# EAGLE schematic dual-channel-buck-v0 (EAGLE 5.07)

## Sheet 1 of 2
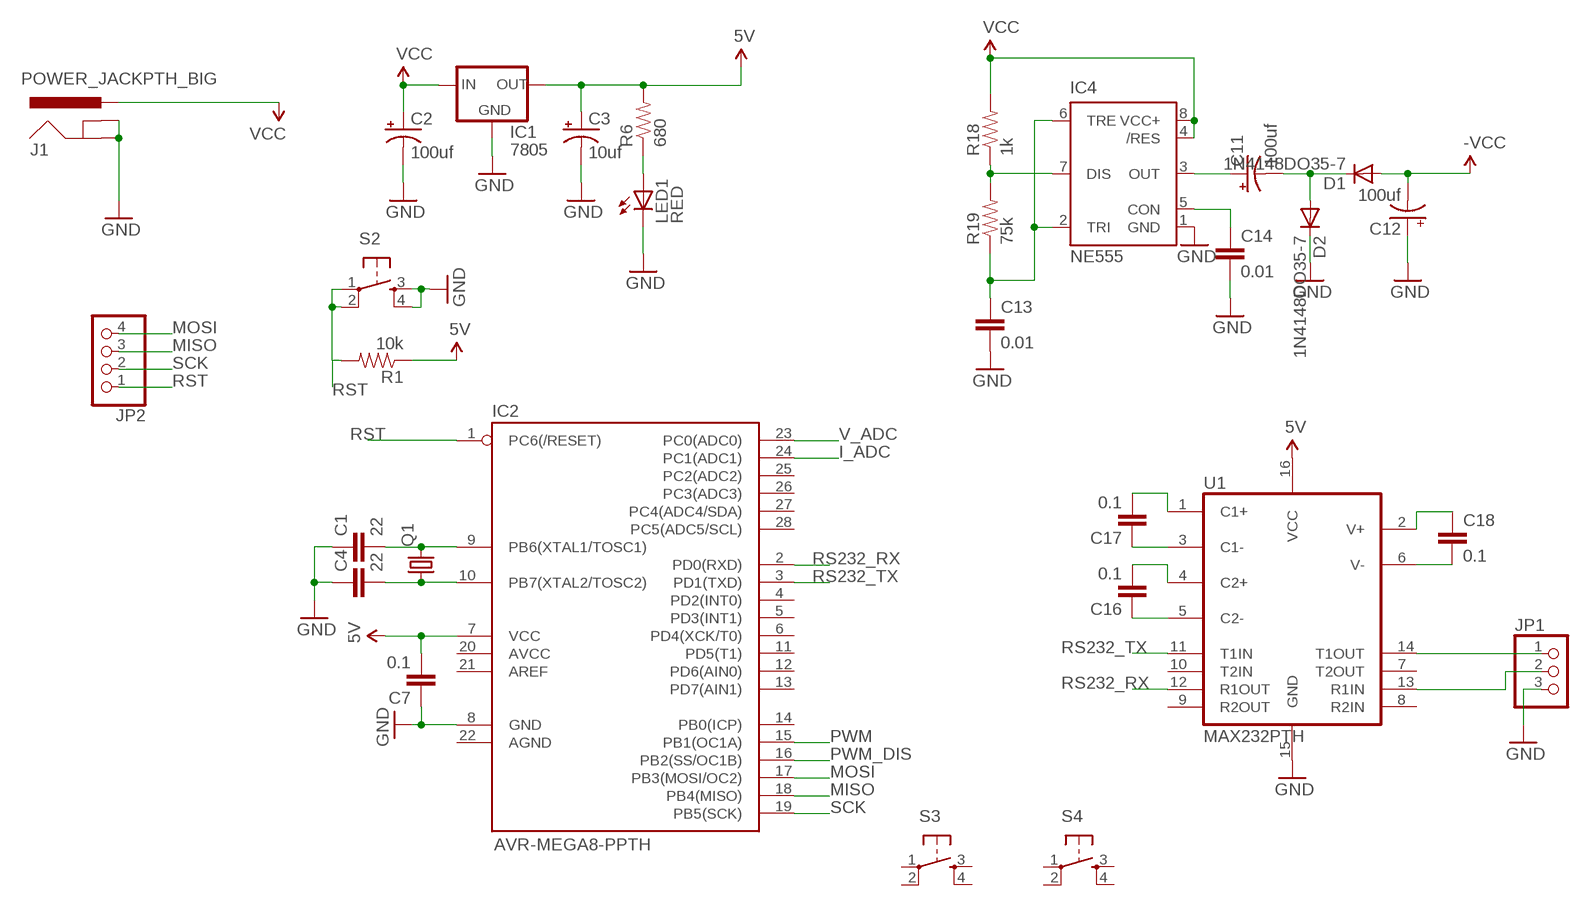
[diagram p0: schematic, sheet 1]

### Parts
C1  22  CAPPTH  [CAP-PTH-SMALL]
C2  100uf  CAP_POLPTH1  [CPOL-RADIAL-100UF-25V]
C3  10uf  CAP_POLPTH2  [CPOL-RADIAL-10UF-25V]
C4  22  CAPPTH  [CAP-PTH-SMALL]
C7  0.1  CAPPTH1  [CAP-PTH-5MM]
C11  100uf  CAP_POLPTH1  [CPOL-RADIAL-100UF-25V]
C12  100uf  CAP_POLPTH1  [CPOL-RADIAL-100UF-25V]
C13  0.01  CAPPTH  [CAP-PTH-SMALL]
C14  0.01  CAPPTH  [CAP-PTH-SMALL]
C16  0.1  CAPPTH  [CAP-PTH-SMALL]
C17  0.1  CAPPTH  [CAP-PTH-SMALL]
C18  0.1  CAPPTH  [CAP-PTH-SMALL]
D1  1N4148DO35-7  [DO35-7]
D2  1N4148DO35-7  [DO35-7]
IC1  7805  V_REG_78XXSIDE  [78XXL]
IC2  AVR-MEGA8-PPTH  [DIL28-3]
IC4  NE555  [DIL-08]
J1  POWER_JACKPTH_BIG  [POWER_JACK_2.1X5.5_BIG_PTH]
JP1  PINHD-1X3  [1X03]
JP2  PINHD-1X4  [1X04]
LED1  RED  LED3MM  [LED3MM]
Q1  CRYSTALHC49US  [HC49US]
R1  10k  RESISTORPTH1  [AXIAL-0.3]
R6  680  RESISTORPTH1  [AXIAL-0.3]
R18  1k  RESISTORPTH1  [AXIAL-0.3]
R19  75k  RESISTORPTH1  [AXIAL-0.3]
S2  TAC_SWITCHPTH  [TACTILE-PTH]
S3  TAC_SWITCHPTH  [TACTILE-PTH]
S4  TAC_SWITCHPTH  [TACTILE-PTH]
U1  MAX232PTH  [DIL16]

### Nets
5V: C3.1(+) C7.2 IC1.OUT IC2.7(VCC) R1.P$1 R6.P$2 U1.16(VCC)
-VCC: C12.2(-) D1.A ; also sheet 2
GND: C1.1 C2.2(-) C3.2(-) C4.1 C7.1 C12.1(+) C13.2 C14.2 D2.C IC1.GND IC2.8(GND) IC4.1(GND) J1.GND J1.GNDBREAK JP1.3 LED1.K(C) S2.3 S2.4 U1.15(GND) ; also sheet 2
I_ADC: IC2.24(PC1(ADC1)) ; also sheet 2
MISO: IC2.18(PB4(MISO)) JP2.3
MOSI: IC2.17(PB3(MOSI/OC2)) JP2.4
N$2: C1.2 IC2.9(PB6(XTAL1/TOSC1)) Q1.2
N$3: C4.2 IC2.10(PB7(XTAL2/TOSC2)) Q1.1
N$10: LED1.A R6.P$1
N$11: IC4.7(DIS) R18.P$1 R19.P$2
N$12: C13.1 IC4.2(TRI) IC4.6(TRE) R19.P$1
N$14: C14.1 IC4.5(CON)
N$19: C11.1(+) IC4.3(OUT)
N$23: C11.2(-) D1.C D2.A
N$24: C17.2 U1.1(C1+)
N$25: C17.1 U1.3(C1-)
N$28: C16.2 U1.4(C2+)
N$29: C16.1 U1.5(C2-)
N$30: C18.1 U1.2(V+)
N$31: C18.2 U1.6(V-)
N$32: JP1.1 U1.14(T1OUT)
N$33: JP1.2 U1.13(R1IN)
PWM: IC2.15(PB1(OC1A)) ; also sheet 2
PWM_DIS: IC2.16(PB2(SS/OC1B)) ; also sheet 2
RS232_RX: IC2.2(PD0(RXD)) U1.12(R1OUT)
RS232_TX: IC2.3(PD1(TXD)) U1.11(T1IN)
RST: IC2.1(PC6(/RESET)) JP2.1 R1.P$2 S2.1 S2.2
SCK: IC2.19(PB5(SCK)) JP2.2
V_ADC: IC2.23(PC0(ADC0)) ; also sheet 2
VCC: C2.1(+) IC1.IN IC4.4(/RES) IC4.8(VCC+) J1.PWR R18.P$2 ; also sheet 2
Unconnected: IC2.4(PD2(INT0)) IC2.5(PD3(INT1)) IC2.6(PD4(XCK/T0)) IC2.11(PD5(T1)) IC2.12(PD6(AIN0)) IC2.13(PD7(AIN1)) IC2.14(PB0(ICP)) IC2.20(AVCC) IC2.21(AREF) IC2.22(AGND) IC2.25(PC2(ADC2)) IC2.26(PC3(ADC3)) IC2.27(PC4(ADC4/SDA)) IC2.28(PC5(ADC5/SCL)) S3.1 S3.2 S3.3 S3.4 S4.1 S4.2 S4.3 S4.4 U1.7(T2OUT) U1.8(R2IN) U1.9(R2OUT) U1.10(T2IN)

## Sheet 2 of 2
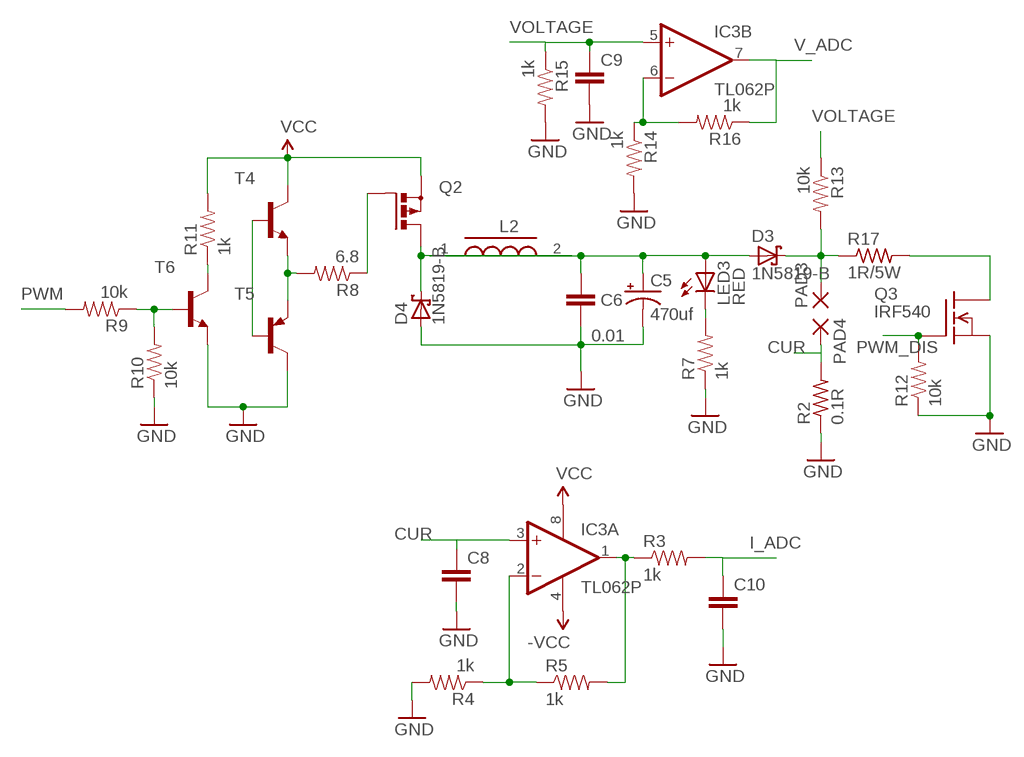
[diagram p1: schematic, sheet 2]

### Parts
C5  470uf  CAP_POLPTH1  [CPOL-RADIAL-100UF-25V]
C6  0.01  CAPPTH  [CAP-PTH-SMALL]
C8  CAPPTH  [CAP-PTH-SMALL]
C9  CAPPTH  [CAP-PTH-SMALL]
C10  CAPPTH  [CAP-PTH-SMALL]
D3  1N5819-B  [DO41-7.6]
D4  1N5819-B  [DO41-7.6]
IC3  TL062P  [DIL08]
L2  INDUCTOR-IED16  [ED16]
LED3  RED  LED3MM  [LED3MM]
PAD3  2,54/1,1  [2,54/1,1]
PAD4  2,54/1,1  [2,54/1,1]
Q2  PMOSFET_PTO220BH  [TO220BH]
Q3  IRF540  [TO220]
R2  0.1R  R-US_0414/15  [0414/15]
R3  1k  RESISTORPTH1  [AXIAL-0.3]
R4  1k  RESISTORPTH1  [AXIAL-0.3]
R5  1k  RESISTORPTH1  [AXIAL-0.3]
R7  1k  RESISTORPTH1  [AXIAL-0.3]
R8  6.8  RESISTORPTH1  [AXIAL-0.3]
R9  10k  RESISTORPTH1  [AXIAL-0.3]
R10  10k  RESISTORPTH1  [AXIAL-0.3]
R11  1k  RESISTORPTH1  [AXIAL-0.3]
R12  10k  RESISTORPTH1  [AXIAL-0.3]
R13  10k  RESISTORPTH1  [AXIAL-0.3]
R14  1k  RESISTORPTH1  [AXIAL-0.3]
R15  1k  RESISTORPTH1  [AXIAL-0.3]
R16  1k  RESISTORPTH1  [AXIAL-0.3]
R17  1R/5W  R-US_0414/15  [0414/15]
T4  -NPN-TO92-EBC  [TO92-EBC]
T5  -PNP-TO92-EBC  [TO92-EBC]
T6  -NPN-TO92-EBC  [TO92-EBC]

### Nets
-VCC: IC3.4(P:V-) ; also sheet 1
CUR: C8.1 IC3.3(A:+IN) PAD4.1(P) R2.2
GND: C5.2(-) C6.2 C8.2 C9.2 C10.2 D4.A Q3.3(S) R2.1 R4.P$2 R7.P$1 R10.P$1 R12.P$1 R14.P$2 R15.P$2 T5.C T6.E ; also sheet 1
I_ADC: C10.1 R3.P$2 ; also sheet 1
N$1: D3.C PAD3.1(P) R13.P$2 R17.1
N$4: Q3.2(D) R17.2
N$5: IC3.2(A:-IN) R4.P$1 R5.P$1
N$6: IC3.1(A:OUT) R3.P$1 R5.P$2
N$7: IC3.6(B:-IN) R14.P$1 R16.P$2
N$9: R9.P$1 R10.P$2 T6.B
N$13: R11.P$1 T6.C
N$16: T4.B T5.B
N$17: R8.P$2 T4.E T5.E
N$18: LED3.K(C) R7.P$2
N$20: Q2.G R8.P$1
N$21: C5.1(+) C6.1 D3.A L2.1 LED3.A
N$22: D4.C L2.2 Q2.D
PWM: R9.P$2 ; also sheet 1
PWM_DIS: Q3.1(G) R12.P$2 ; also sheet 1
V_ADC: IC3.7(B:OUT) R16.P$1 ; also sheet 1
VCC: IC3.8(P:V+) Q2.S R11.P$2 T4.C ; also sheet 1
VOLTAGE: C9.1 IC3.5(B:+IN) R13.P$1 R15.P$1

## Library data of the parts
C1 C4 C6-C10 C13 C14 C16-C18 = SparkFun:CAP: Capacitor Standard 0603 ceramic capacitor, and 0.1" leaded capacitor.
C2 C3 C5 C11 C12 = SparkFun:CAP_POL: Capacitor Polarized These are standard SMD and PTH capacitors. Normally 10uF, 47uF, and 100uF in electrolytic and tantalum varieties. Always verify the external diameter of the through hole cap, it varies with capacity, voltage, and manufacturer. The EIA devices should be standard.
D1 D2 = diode:1N4148: DIODE high speed (Philips)
D3 D4 = diode:1N581*: 1.0A SCHOTTKY BARRIER RECTIFIER Source: http://www.diodes.com/datasheets/ds23001.pdf
IC1 = SparkFun:V_REG_78XX: Voltage Regulator Standard 7805 5V regulator. IGO (Input Ground Output). Spark Fun Electronics SKU : COM-00107
IC2 = SparkFun:AVR-MEGA8-P: MICROCONTROLLER 8 Kbytes FLASH 1 kbytes SRAM 512 bytes EEPROM USART 4-channel 10 bit ADC 2-channel 8 bit ADC
IC3 = linear:TL062: OP AMP
IC4 = st-microelectronics:NE555: General purpose bipolar Timer
J1 = digital-toy:POWER_JACK: Power Jack This is the standard 5.5mm barrel jack for power. The PTH is the most common, proven, reliable, footprint. All others are experimental. The Slot footprint only works if the mill layer is transmitted to the PCB fab house so be warned. Spark Fun Electronics SKU : PRT-00119. Mating wall wart : TOL-00298 (and others)
JP1 = pinhead:PINHD-1X3: PIN HEADER
JP2 = pinhead:PINHD-1X4: PIN HEADER
L2 = digital-toy:INDUCTOR-I: Inductors with Iron
LED1 LED3 = SparkFun:LED: LEDs Standard schematic elements and footprints for 5mm, 3mm, 1206, and 0603 sized LEDs. 5mm - Spark Fun Electronics SKU : COM-00529 (and others)
PAD3 PAD4 = wirepad:2,54/1,1: THROUGH-HOLE PAD
Q1 = SparkFun:CRYSTAL: Crystals Various standard crystals. Proven footprints. Spark Fun Electronics SKU : COM-00534
Q2 = transistor-power:PMOSFET_P: Power MOSFET P-Channel
Q3 = transistor-fet:IRF540: N-Channel Enhancement MOSFET (HEXFET); 100V; 28A; 0,077Ohm
R1 R3-R16 R18 R19 = SparkFun:RESISTOR: Resistor Basic schematic elements and footprints for 0603, 1206, and PTH 1/10th watt (small) resistors.
R2 R17 = rcl:R-US_: RESISTOR, American symbol
S2-S4 = SparkFun:TAC_SWITCH: Momentary Switch Button commonly used for reset or general input. Spark Fun Electronics SKU : COM-00097
T4 T6 = digital-toy:*-NPN-: NPN Transistror
T5 = digital-toy:*-PNP-: PNP Transistror
U1 = SparkFun:MAX232: RS232 Transceiver Very common IC. This is generically called 'MAX232', but works with the 3V equivalent MAX3232 generic ICs. Field tested and mother approved. Spark Fun Electronics SKU : COM-00316 (DIP) and COM-00589 (SMD)